# EAGLE schematic openSX70-dongle_v6-1-dual-led (EAGLE 9.4.2)
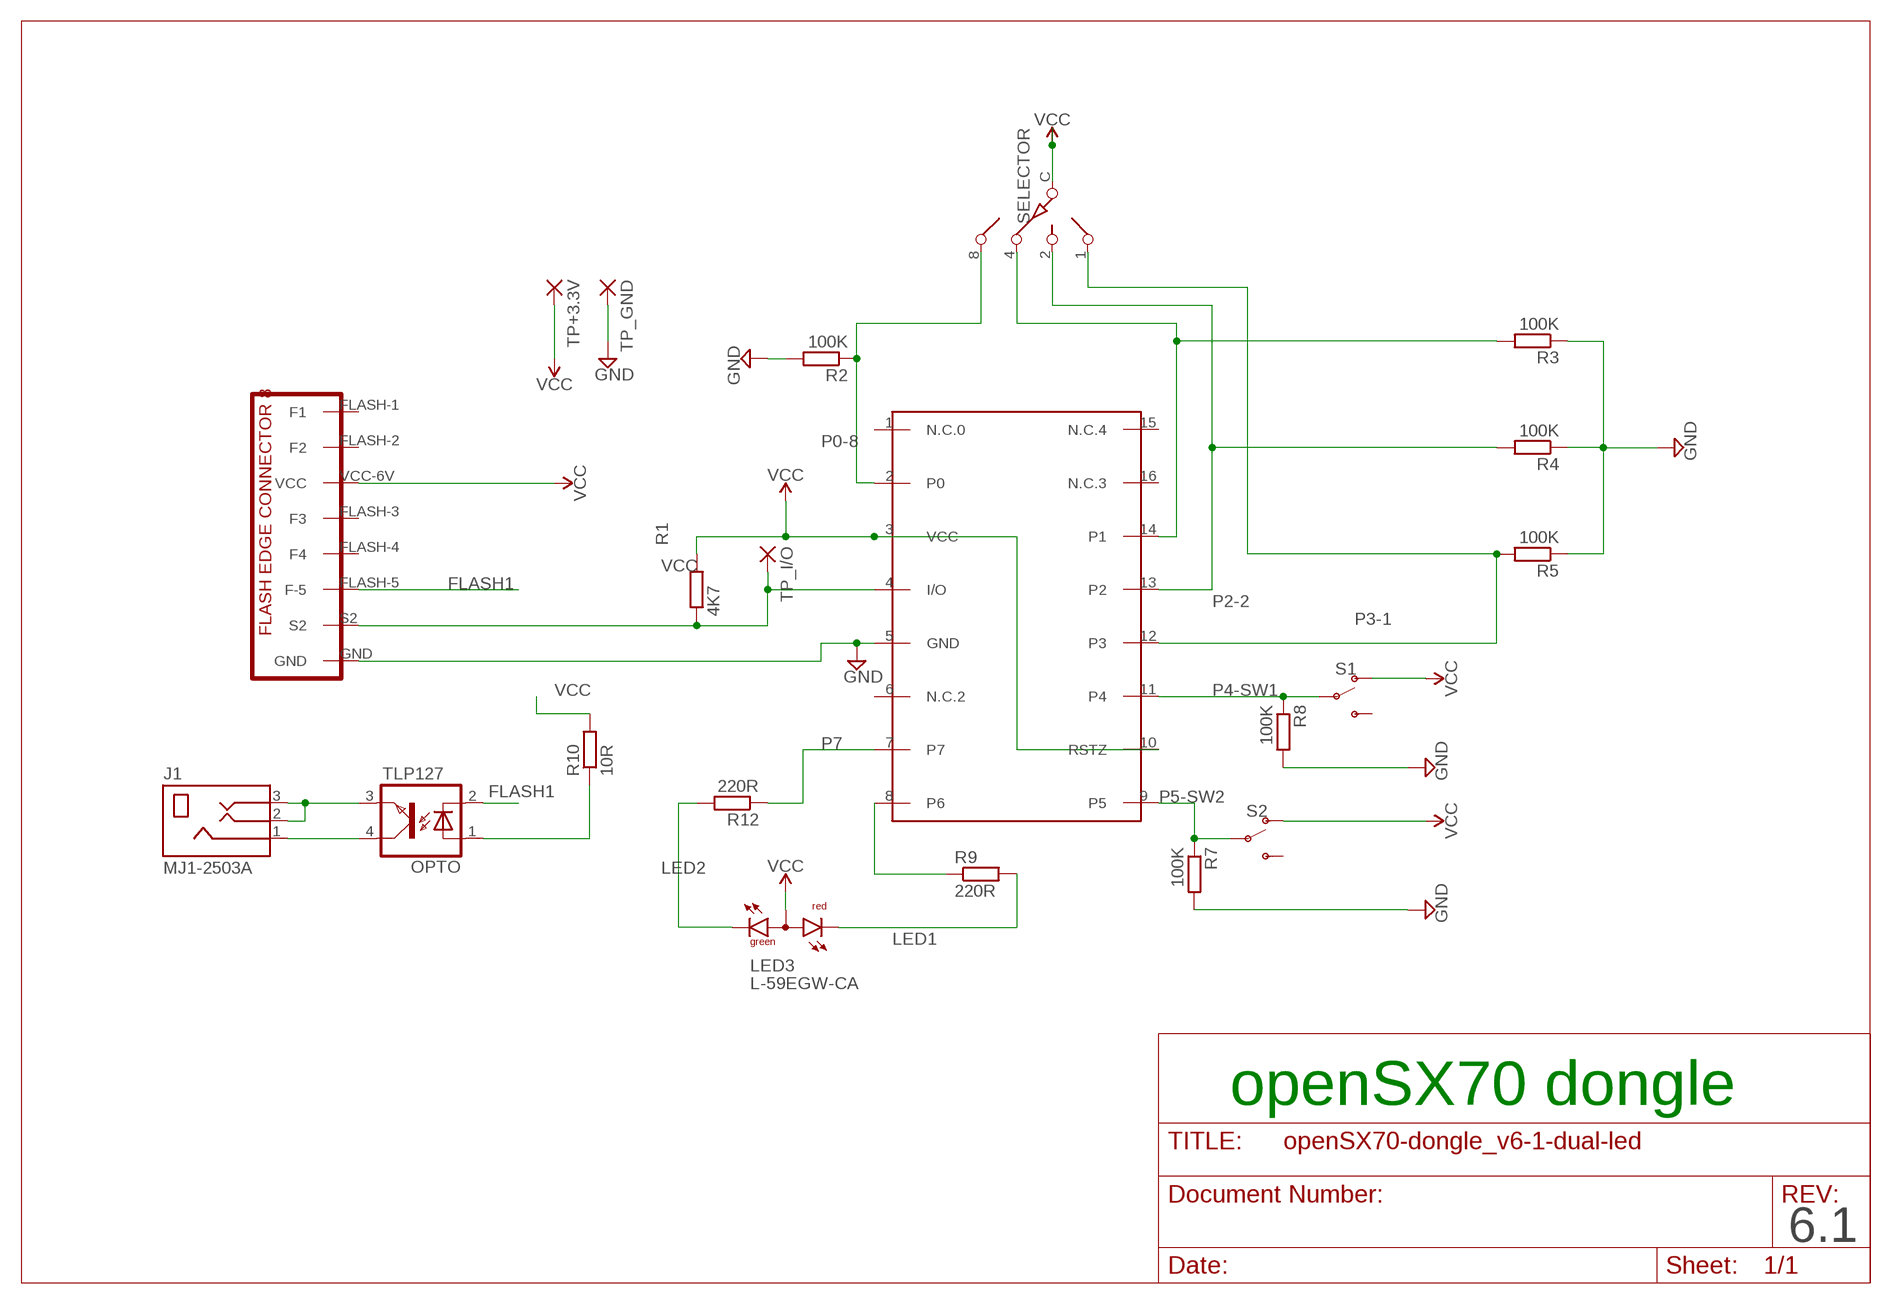
[diagram p0: schematic, sheet 1]

## Parts
DS2408  DS2408  [SO16]
J1  MJ1-2503A  [CUI_MJ1-2503A]
LED3  L-59EGW-CA  [L-59EGW-CA]
OPTO  TLP127  [SO-4]
R1  4K7  R-EU_R0603  [R0603]
R2  100K  R-EU_R0603  [R0603]
R3  100K  R-EU_R0603  [R0603]
R4  100K  R-EU_R0603  [R0603]
R5  100K  R-EU_R0603  [R0603]
R7  100K  R-EU_R0603  [R0603]
R8  100K  R-EU_R0603  [R0603]
R9  220R  R-EU_R0603  [R0603]
R10  10R  R-EU_R0603  [R0603]
R12  220R  R-EU_R0603  [R0603]
S1  SWITCH-SPDT-SMD-RIGHT-ANGLE  [SWITCH_SPST_SMD_A]
S2  SWITCH-SPDT-SMD-RIGHT-ANGLE  [SWITCH_SPST_SMD_A]
SELECTOR  SW-C16  [SW-C16]
TP+3.3V  SMD2  [SMD1,27-2,54]
TP_GND  SMD2  [SMD1,27-2,54]
TP_I/O  SMD2  [SMD1,27-2,54]
U$2  SX70-FLASH-EDGE8-MALE-PROPER  [SX70-FLASH-EDGE8]

## Nets
FLASH1: OPTO.2(C) U$2.FLASH-5(F-5)
GND: DS2408.5(GND) R2.2 R3.1 R4.1 R5.1 R7.2 R8.2 TP_GND.1(P) U$2.GND
LED1: LED3.1(CR) R9.2
LED2: LED3.3(CG) R12.2
N$9: J1.1 OPTO.4(COL)
N$12: OPTO.1(A) R10.1
N$15: J1.2 J1.3 OPTO.3(EMIT)
P0-8: DS2408.2(P0) R2.1 SELECTOR.8
P1-4: DS2408.14(P1) R3.2 SELECTOR.4
P2-2: DS2408.13(P2) R4.2 SELECTOR.2
P3-1: DS2408.12(P3) R5.2 SELECTOR.1
P4-SW1: DS2408.11(P4) R8.1 S1.2(P)
P5-SW2: DS2408.9(P5) R7.1 S2.2(P)
P6: DS2408.8(P6) R9.1
P7: DS2408.7 R12.1
S2+: DS2408.4(I/O) R1.1 TP_I/O.1(P) U$2.S2
VCC: DS2408.3(VCC) DS2408.10(RSTZ) LED3.2(A) R1.2 R10.2 S1.1(O) S2.1(O) SELECTOR.C TP+3.3V.1(P) U$2.VCC-6V(VCC)
Unconnected: DS2408.1(N.C.0) DS2408.6(N.C.2) DS2408.15(N.C.4) DS2408.16(N.C.3) S1.3(S) S2.3(S) U$2.FLASH-1(F1) U$2.FLASH-2(F2) U$2.FLASH-3(F3) U$2.FLASH-4(F4)

## Notes on the sheet
- openSX70 dongle
- 6.1

## Library data of the parts
DS2408 = DS2408-joaco:DS2408
J1 = MJ1-2503A:MJ1-2503A: 2.5 mm, Mono, Right Angle, Through Hole, Audio Jack Connector; CUI_PURCHASE_URL: https://www.cui.com/product/interconnect/connectors/audio-connectors/jacks/mj1-2503a?utm_source=snapeda.com&utm_medium=referral&utm_campaign=snapedaBOM; DESCRIPTION: 2.5 mm, Mono, Right Angle, Through Hole, Audio Jack Connector; DIGI-KEY_PART_NUMBER: CP1-2503AM-ND; DIGI-KEY_PURCHASE_URL: https://www.digikey.com/product-detail/en/cui-inc/MJ1-2503A/CP1-2503AM-ND/738679?utm_source=snapeda&utm_medium=aggregator&utm_campaign=symbol; MF: CUI Inc.; MP: MJ1-2503A; PACKAGE: None
LED3 = led:L-59EGW-CA: T-1 3/4 (5mm) BI-COLOR INDICATOR LAMP Source: http://www.kingbright.com/manager/upload/pdf/L-59EGW-CA%28Ver1292805989.13%29
OPTO = openSX70:TLP127
R1-R5 R7-R9 R12 = rcl:R-EU_: RESISTOR, European symbol; SPICEPREFIX: R
R10 = resistor:R-EU_: RESISTOR, European symbol
S1 S2 = SparkFun-Switches:SWITCH-SPDT: Single Pole, Double Throw (SPDT) Switch Single-pole, double-throw (SPDT) switch. Variant Overview SMD-AYZ0202 Surface Mount DPDT Switch <https://www.sparkfun.com/products/597> (COM-00597) Used on e.g. LilyPad Arduino USB - ATmega32U4 Board <https://www.sparkfun.com/products/12049> PTH-11.6X4.0MM SPDT Mini Power Switch <https://www.sparkfun.com/products/102> (COM-00102) Used on e.g. SparkFun Simon Says - Through-Hole Soldering Kit <https://www.sparkfun.com/products/10547> (KIT-10547) PTH-11.6X4.0MM-KIT KIT version of SPDT Mini Power Switch - Simplifies soldering by removing tStop of switch pins - only one side can be soldered. PTH-11.6X4.0MM-LOCK LOCK version of SPDT Mini Power Switch - Offset pins hold switch in place for easier soldering. SMD-RIGHT-ANGLE Surface Mount Right Angle Switch <https://www.sparkfun.com/products/10860> (COM-10860) Used on e.g. SparkFun ESP8266 Thing <https://www.sparkfun.com/products/13231>; PROD_ID: SWCH-10651; SF_SKU: COM-10860
SELECTOR = special:SW-C16: SWITCH 16-step rotary switch
TP+3.3V TP_GND TP_I/O = wirepad:SMD2: SMD PAD
U$2 = _openSX70:SX70-FLASH-EDGE8-MALE-PROPER

## Net classes
0 GND: width 0.305 mm
1 VCC: width 0.254 mm
2 2.8V: width 0.254 mm